# Altium schematic sheet Regulator.SchDoc
size A; SheetNumber: 2; SheetTotal: 2
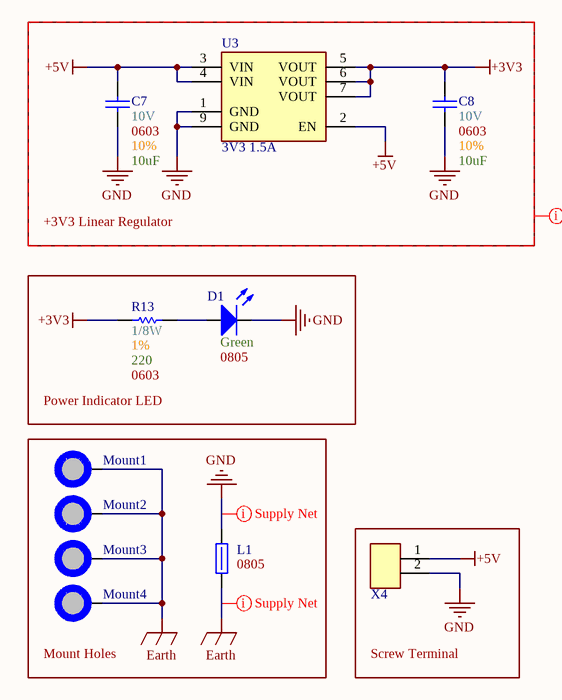
[diagram p0: Regulator.SchDoc]

## Parts
C7  Max Voltage: 10V  Size Package: 0603  Tolerance: 10%  Capacitance: 10uF  [[Cap] SMD 0603]  (hidden comment: [Cap] 0603 10uF 10% 10V)
C8  Max Voltage: 10V  Size Package: 0603  Tolerance: 10%  Capacitance: 10uF  [[Cap] SMD 0603]  (hidden comment: [Cap] 0603 10uF 10% 10V)
D1  Color: Green  Size Package: 0805  [[LED] SMD 0805]  (hidden comment: [LED] SMD 0805 Green)
L1  Size Package: 0805  [[Ferrite] SMD 0805]  (hidden comment: 652-MH2029-300Y)
Mount1  M3 Mount Hole  [[Mount] M3 Mount Hole]  (value not drawn)  (no BOM)
Mount2  M3 Mount Hole  [[Mount] M3 Mount Hole]  (value not drawn)  (no BOM)
Mount3  M3 Mount Hole  [[Mount] M3 Mount Hole]  (value not drawn)  (no BOM)
Mount4  M3 Mount Hole  [[Mount] M3 Mount Hole]  (value not drawn)  (no BOM)
R13  Wattage: 1/8W  Tolerance: 1%  Resistance: 220  Size Package: 0603  [[Res] SMD 0603]  (hidden comment: [220] SMD 0603 1% 1/10W)
U3  3V3 1.5A  [[Linear] 3V3 1.5A]
X4  2pin Screw Terminal  [[Screw Terminal] 2pin 5mm]  (value not drawn)

## Blocks framed on the sheet
+3V3 Linear Regulator: C7 C8 U3
Power Indicator LED: D1 R13
Mount Holes: L1 Mount1-Mount4
Screw Terminal: X4

## Nets
+3V3: C8.2 R13.1 U3.5(VOUT) U3.6(VOUT) U3.7(VOUT)
+5V: C7.2 U3.2(EN) U3.3(VIN) U3.4(VIN) X4.1
Earth: L1.1 Mount1.1 Mount2.1 Mount3.1 Mount4.1
GND: C7.1 C8.1 D1.2(Cathode) L1.2 U3.1(GND) U3.9(GND) X4.2
NetD1_1: D1.1(Anode) R13.2

## Layout directives
net class Supply_Nets: +3V3, +5V, Earth, GND

## Library data of the parts
C7 C8 = [Cap] 0603 10uF 10% 10V: CL10A106KP8NNNC; Supplier 1: DigiKey; Supplier Part Number 1: 1276-1192-6-ND
D1 = [LED] SMD 0805 Green: LG R971-KN-1-0-20-R18; Supplier 1: DigiKey; Supplier Part Number 1: 475-LGR971-KN-1CT-ND
L1 = [Ferrite] SMD 0805 3A 30ohm: Res @ Freq: 30 @ 100MHz; Supplier 1: DigiKey; Supplier Part Number 1: MH2029-300YCT-ND
Mount1-Mount4 = [Mount] M3 Mount Hole: Place at least 4.5mm from board edge. Plated.
R13 = [220] SMD 0603 1% 1/10W: CRGCQ0805F220R; Supplier 1: DigiKey; Supplier Part Number 1: A129741CT-ND
U3 = [Linear] 3V3 1.5A: AP7362A-33SP-13; Supplier 1: DigiKey; Supplier Part Number 1: AP7362A-33SP-13DICT-ND
X4 = [Screw Terminal] 2pin: TB002-500-02BE; Supplier 1: DigiKey; Supplier Part Number 1: 102-6145-ND